# Altium schematic sheet LPCB221 - MLP.SchDoc
size A3; Address1: Factory 10; Address2: 9-13 Dingley Avenue, Dandeong, VICTORIA 3175, AUSTRALIA; DocumentNumber: 5; Revision: 1; SheetNumber: 5; SheetTotal: 6; Lockie__PCB_SUB_ASSEMBLY: MLP Interface; Lockie__PCB_ASSEMBLY: Node Base; Lockie__LDL: LPCB221; Lockie__PCB_DESCRIPTION: Gimbal Node
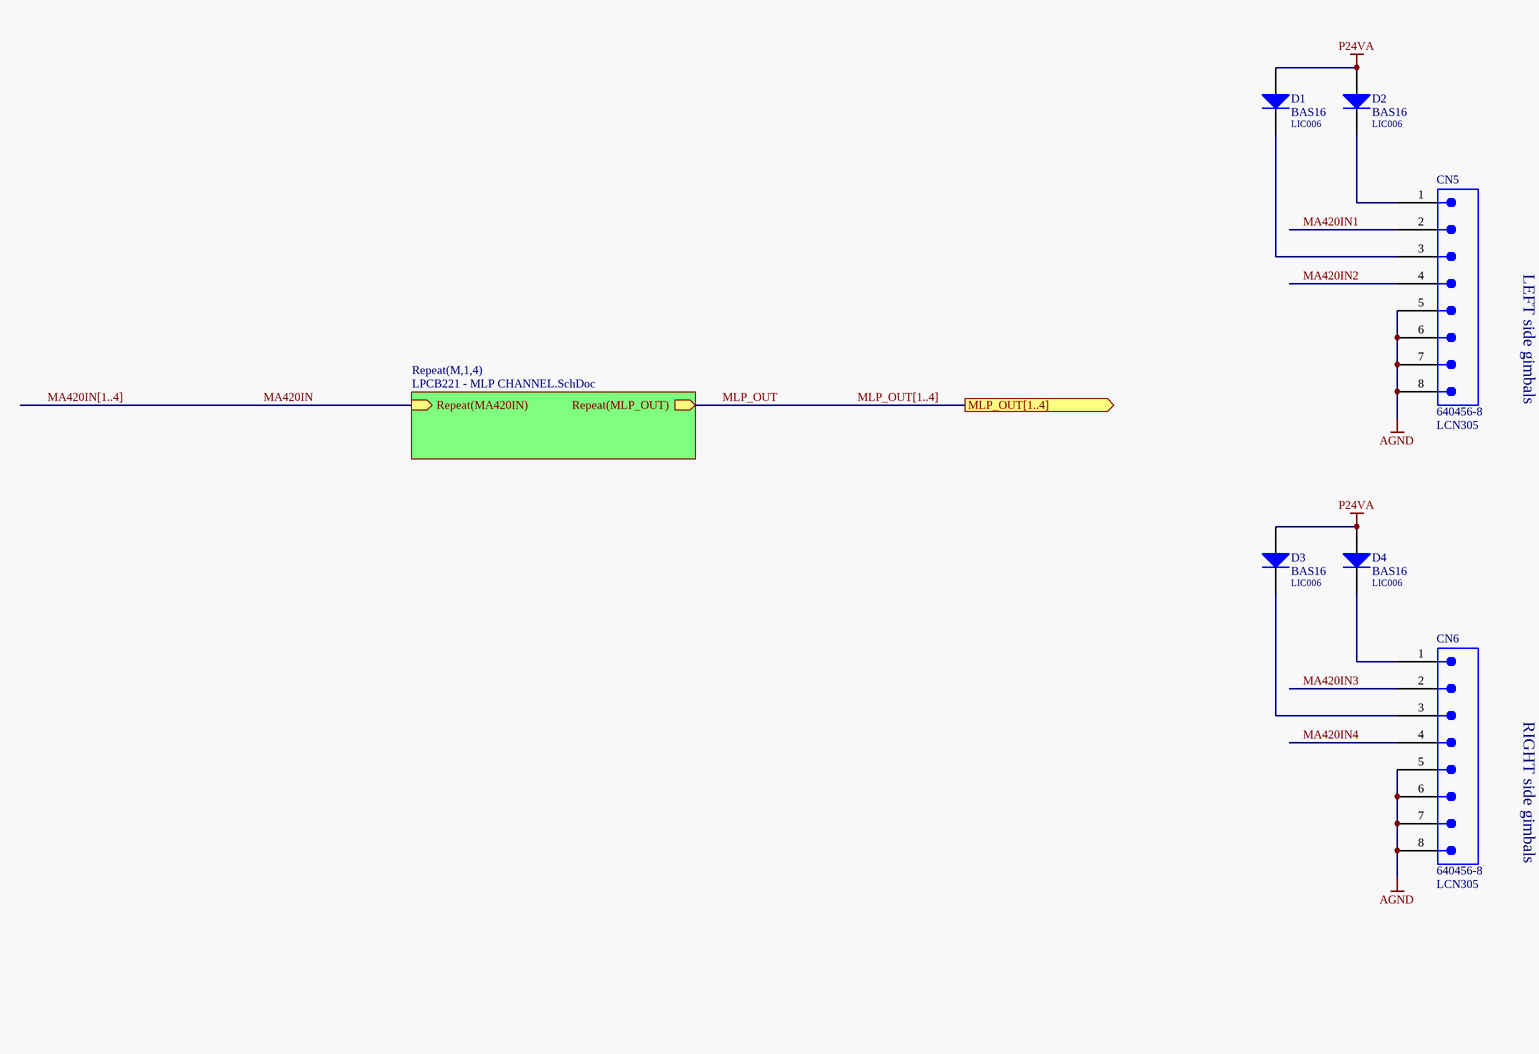
[diagram p0: LPCB221 - MLP.SchDoc]

## Parts
CN5  640456-8  LDL_NUMBER: LCN305  [640456-8]
CN6  640456-8  LDL_NUMBER: LCN305  [640456-8]
D1  BAS16  LDL_NUMBER: LIC006  [LFP021__SOT23]
D2  BAS16  LDL_NUMBER: LIC006  [LFP021__SOT23]
D3  BAS16  LDL_NUMBER: LIC006  [LFP021__SOT23]
D4  BAS16  LDL_NUMBER: LIC006  [LFP021__SOT23]

## Sub-sheets
Repeat(M,1,4) = LPCB221 - MLP CHANNEL.SchDoc: Repeat(MA420IN) (in), Repeat(MLP_OUT) (out)

## Ports
MLP_OUT[1..4] (out)

## Nets
AGND: CN5.5 CN5.6 CN5.7 CN5.8 CN6.5 CN6.6 CN6.7 CN6.8
P24VA: D1.1(A) D2.1(A) D3.1(A) D4.1(A)
MA420IN: sheet Repeat(M,1,4)/Repeat(MA420IN)
MA420IN1: CN5.2
MA420IN2: CN5.4
MA420IN3: CN6.2
MA420IN4: CN6.4
MLP_OUT: sheet Repeat(M,1,4)/Repeat(MLP_OUT)
NetCN5_1: CN5.1 D2.3(K)
NetCN5_3: CN5.3 D1.3(K)
NetCN6_1: CN6.1 D4.3(K)
NetCN6_3: CN6.3 D3.3(K)

## Buses and harness runs
bus MA420IN[1..4]
bus MLP_OUT[1..4] = port MLP_OUT[1..4]

## Notes on the sheet
- LEFT side gimbals
- RIGHT side gimbals
- PCB COMPONENT DESCRIPTION
- LDL NUMBER
- Assembly Details
- Size
- Drawing File Name
- Revision
- http://rloop.org
- Scale
- A3
- Sheet Details
- N.T.S
- Sheet:
- Of:

## Library data of the parts
CN5 CN6 = 640456-8: Connector, Male Header, 8 Way; FMEDA__CHANNEL: COM; FMEDA__OPERATING__CURRENT_MAX: 0; FMEDA__OPERATING__TEMP_MAX: 50; FMEDA__OPERATING__TEMP_MIN: -20; FMEDA__OPERATING__TEMP_TYP: 27; FMEDA__OPERATING__VOLTAGE_MAX: 16; FMEDA__OPERATING__VOLTAGE_TYP: 12; FMEDA__FUNCTION_IN_SYSTEM: *; FMEDA__OPERATING__CURRENT_MIN: 0; FMEDA__OPERATING__CURRENT_TYP: 0; FMEDA__OPERATING__VOLTAGE_MIN: 0
D1-D4 = BAS16: Diode, Small Signal, 0.2A, 85V, SMD SOT-23 [LIC006]; FMEDA__OPERATING__CURRENT_MIN: 0; FMEDA__OPERATING__TEMP_MIN: -20; FMEDA__OPERATING__TEMP_TYP: 27; FMEDA__OPERATING__TEMP_MAX: 50; FMEDA__CHANNEL: COM; FMEDA__OPERATING__CURRENT_MAX: 0; FMEDA__OPERATING__VOLTAGE_MIN: 0; FMEDA__OPERATING__VOLTAGE_MAX: 0; FMEDA__FUNCTION_IN_SYSTEM: *; FMEDA__OPERATING__CURRENT_TYP: 0; FMEDA__OPERATING__VOLTAGE_TYP: 0